# EAGLE design SparkFun_Simblee_Breakout_v11 (EAGLE 7.3.0)
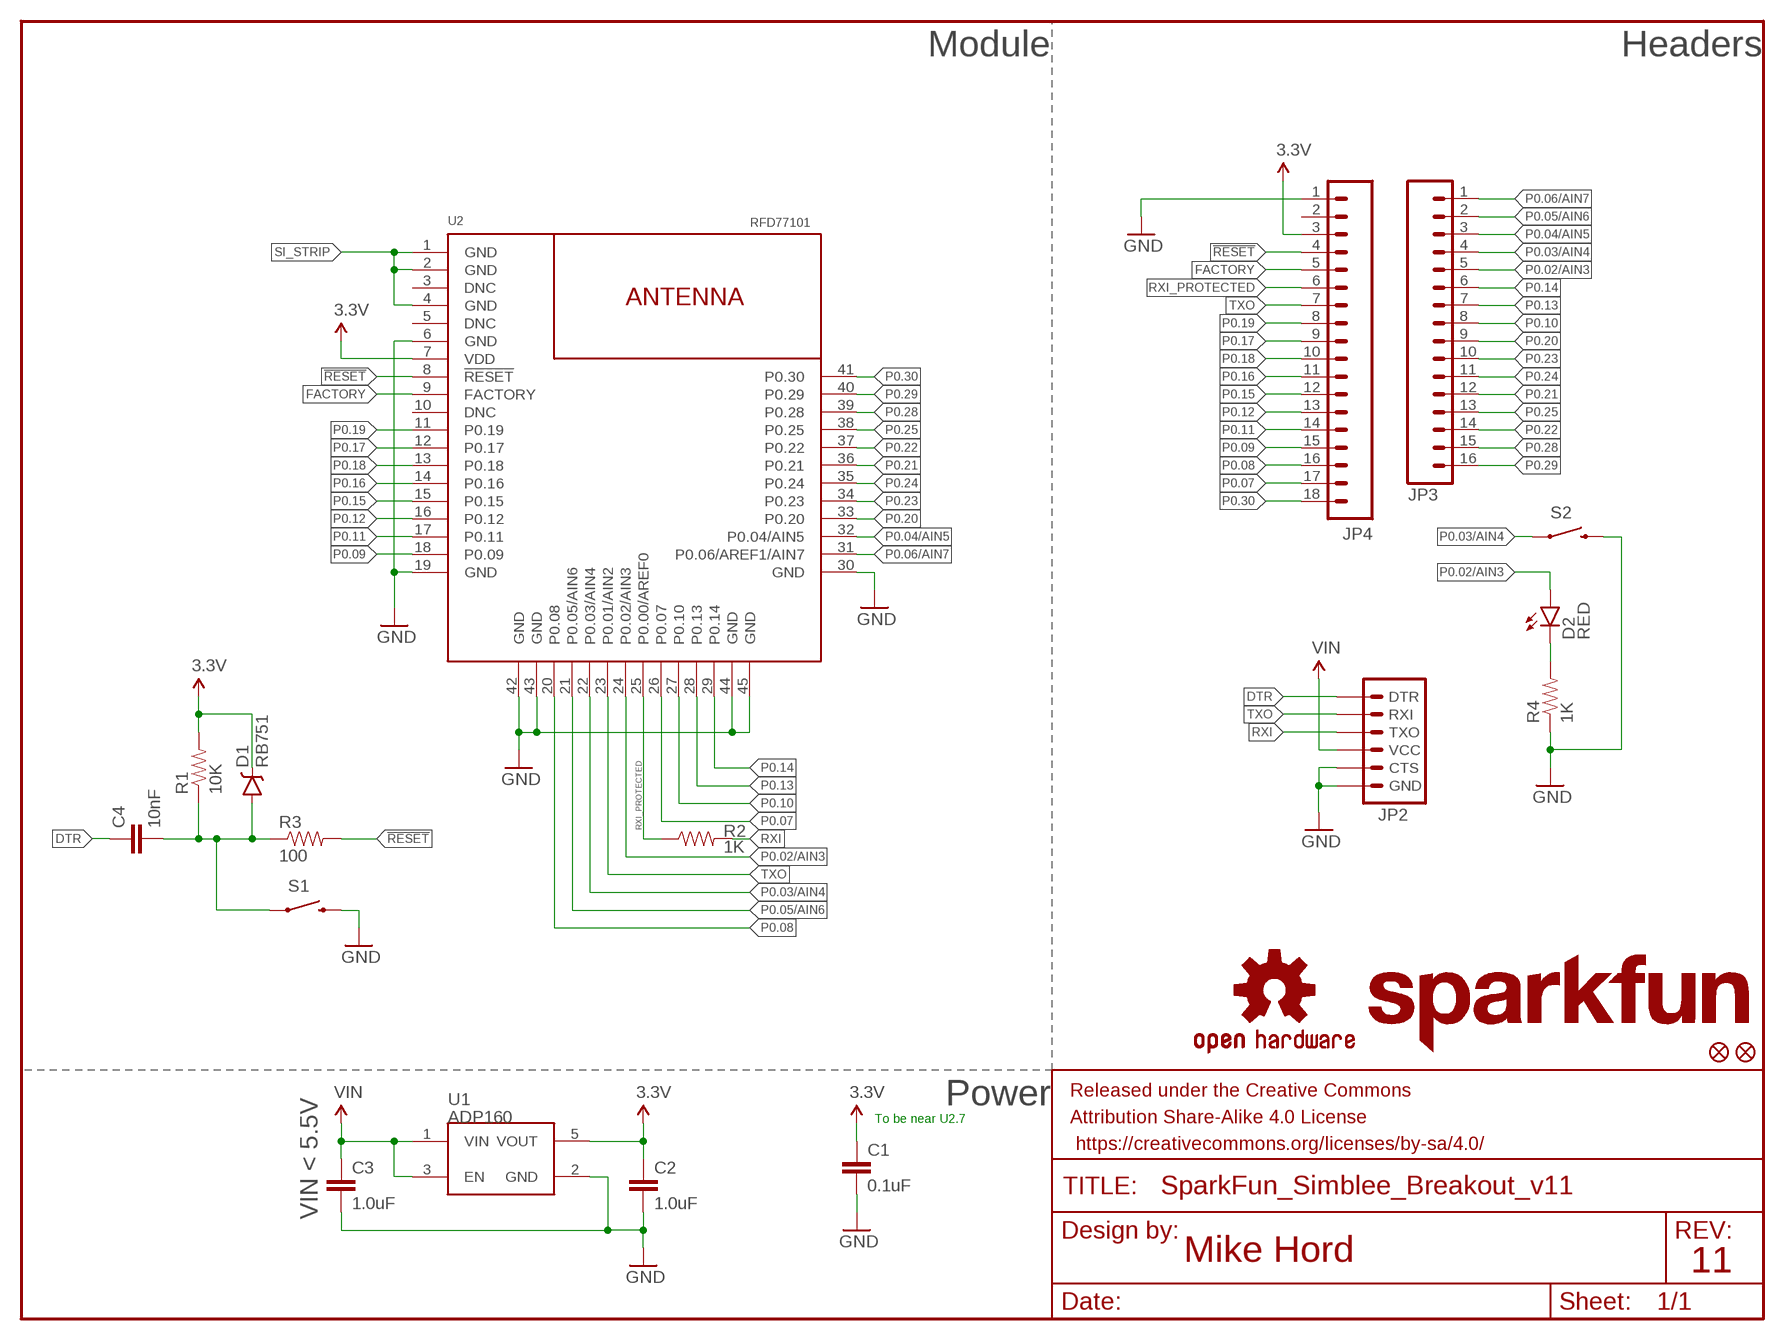
[diagram p0: schematic, sheet 1]

## Parts
C1  0.1uF  0.1UF-25V(+80/-20%)(0603)  [0603-CAP]
C2  1.0uF  1.0UF-16V-10%(0603)  [0603-CAP]
C3  1.0uF  1.0UF-16V-10%(0603)  [0603-CAP]
C4  10nF  10NF/10000PF-50V-10%(0603)  [0603-CAP]
D1  RB751  DIODE-SCHOTTKY-RB751  [SOD-523]
D2  RED  LED-RED0603  [LED-0603]
FID1  FIDUCIALUFIDUCIAL  [MICRO-FIDUCIAL]
FID2  FIDUCIALUFIDUCIAL  [MICRO-FIDUCIAL]
FRAME1  FRAME-LETTER  [CREATIVE_COMMONS]
JP2  ARDUINO_SERIAL_PROGRAMPTH  [1X06]
JP3  M16PTH  [1X16]
JP4  M18_  [1X18]
LOGO1  SFE_LOGO_NAME.1_INCH  [SFE_LOGO_NAME_.1]
LOGO2  OSHW-LOGOS  [OSHW-LOGO-S]
LOGO3  SFE_LOGO_NAME.1_INCH  [SFE_LOGO_NAME_.1]
LOGO4  OSHW-LOGOS  [OSHW-LOGO-S]
R1  10K  10KOHM-1/10W-1%(0603)0603  [0603-RES]
R2  1K  1KOHM-1/10W-1%(0603)  [0603-RES]
R3  100  100OHM-1/10W-1%(0603)  [0603-RES]
R4  1K  1KOHM-1/10W-1%(0603)  [0603-RES]
S1  SWITCH-MOMENTARY-2SMD  [TACTILE-SWITCH-SMD]
S2  SWITCH-MOMENTARY-2SMD  [TACTILE-SWITCH-SMD]
U1  ADP160  [SOT23-5]
U2  RFD77101  [RFD77101]

## Nets
3.3V: C1.1 C2.1 D1.C JP4.3 R1.2 U1.5(VOUT) U2.7(VDD)
!RESET: JP4.4 R3.2 U2.8(!RESET!)
DTR: C4.1 JP2.1(DTR)
FACTORY: JP4.5 U2.9(FACTORY)
GND: C1.2 C2.2 C3.2 JP2.5(CTS) JP2.6(GND) JP4.1 R4.1 S1.3 S2.3 U1.2(GND) U2.6(GND) U2.19(GND) U2.30(GND) U2.42(GND) U2.43(GND) U2.44(GND) U2.45(GND)
N$1: C4.2 D1.A R1.1 R3.1 S1.1
N$2: D2.C R4.2
P0.02/AIN3: D2.A JP3.5 U2.24(P0.02/AIN3)
P0.03/AIN4: JP3.4 S2.1 U2.22(P0.03/AIN4)
P0.04/AIN5: JP3.3 U2.32(P0.04/AIN5)
P0.05/AIN6: JP3.2 U2.21(P0.05/AIN6)
P0.06/AIN7: JP3.1 U2.31(P0.06/AREF1/AIN7)
P0.07: JP4.17 U2.26(P0.07)
P0.08: JP4.16 U2.20(P0.08)
P0.09: JP4.15 U2.18(P0.09)
P0.10: JP3.8 U2.27(P0.10)
P0.11: JP4.14 U2.17(P0.11)
P0.12: JP4.13 U2.16(P0.12)
P0.13: JP3.7 U2.28(P0.13)
P0.14: JP3.6 U2.29(P0.14)
P0.15: JP4.12 U2.15(P0.15)
P0.16: JP4.11 U2.14(P0.16)
P0.17: JP4.9 U2.12(P0.17)
P0.18: JP4.10 U2.13(P0.18)
P0.19: JP4.8 U2.11(P0.19)
P0.20: JP3.9 U2.33(P0.20)
P0.21: JP3.12 U2.36(P0.21)
P0.22: JP3.14 U2.37(P0.22)
P0.23: JP3.10 U2.34(P0.23)
P0.24: JP3.11 U2.35(P0.24)
P0.25: JP3.13 U2.38(P0.25)
P0.28: JP3.15 U2.39(P0.28)
P0.29: JP3.16 U2.40(P0.29)
P0.30: JP4.18 U2.41(P0.30)
RXI: JP2.3(TXO) R2.2
RXI_PROTECTED: JP4.6 R2.1 U2.25(P0.00/AREF0)
SI_STRIP: U2.1(GND) U2.2(GND) U2.4(GND)
TXO: JP2.2(RXI) JP4.7 U2.23(P0.01/AIN2)
VIN: C3.1 JP2.4(VCC) U1.1(VIN) U1.3(EN)
Unconnected: JP4.2 U2.3(DNC) U2.5(DNC) U2.10(DNC)

## Notes on the sheet
- Module | Headers
- Power
- To be near U2.7
- VIN < 5.5V
- Mike Hord
- 11

## Library data of the parts
C1 = SparkFun-Capacitors:0.1UF-25V(+80/-20%)(0603): CAP-00810 Ceramic Standard decoupling cap; PROD_ID: CAP-00810
C2 C3 = SparkFun-Capacitors:1.0UF-16V-10%(0603): CAP-00868; PROD_ID: CAP-00868
C4 = SparkFun-Capacitors:10NF/10000PF-50V-10%(0603): CAP-00867; PROD_ID: CAP-00867
D1 = SparkFun-DiscreteSemi:DIODE-SCHOTTKY: Schottky diodes in SFE's production catalog BAT20J 1A 23V 0.62Vf RB751 120mA 40V 0.37Vf PMEG4005EJ 0.5A 40V 0.42Vf MBRA140 1A 40V 0.5Vf B340A 3A 40V SMA; PROD_ID: DIO-11018
D2 = SparkFun-LED:LED-RED: Assorted Red LEDs LilyPad 1206- DIO-09912 1206- DIO-00809 0603- DIO-00819 "SMART" means more efficient and expensive; PROD_ID: DIO-00819
FID1 FID2 = SparkFun-Aesthetics:FIDUCIAL: Fiducial Alignment Points Various fiducial points for machine vision alignment.
FRAME1 = SparkFun-Aesthetics:FRAME-LETTER: Schematic Frame Standard 8.5x11 US Letter frame
JP2 = SparkFun-Connectors:ARDUINO_SERIAL_PROGRAM: FTDI connector footprints
JP3 = SparkFun-Connectors:M16: 1x16 .1" header
JP4 = SparkFun-Connectors:M18: 1x18 .1" header
LOGO1 LOGO3 = SparkFun-Aesthetics:SFE_LOGO_NAME: SFE Logo, name only This is the SparkFun name logo. The logo on the schematic will always be the same size; the package variant is the height of the flame part of the logo (or the height the flame would be, if it were drawn). Default layer for the logo on the board is tSilk.
LOGO2 LOGO4 = SparkFun-Aesthetics:OSHW-LOGO: Open Source Hardware Logo This logo indicates the piece of hardware it is found on incorporates a OSHW license and/or adheres to the definition of open source hardware found here: http://freedomdefined.org/OSHW
R1 = SparkFun-Resistors:10KOHM-1/10W-1%(0603): RES-00824; PROD_ID: RES-00824
R2 R4 = SparkFun-Resistors:1KOHM-1/10W-1%(0603): RES-07856; PROD_ID: RES-07856
R3 = SparkFun-Resistors:100OHM-1/10W-1%(0603): RES-07863; PROD_ID: RES-07863
S1 S2 = SparkFun-Electromechanical:SWITCH-MOMENTARY-2: Various NO switches- pushbuttons, reed, etc; PROD_ID: SWCH-08247
U1 = SparkFun-PowerIC:ADP160: Nanopower LDO Iq less than 1uA for low Iload; PROD_ID: VREG-11306
U2 = RFDigital:RFD77101: Simblee ™ BLE Module RFD77101 © 2015 RF Digital Corporation www.RFDigital.com www.Simblee.com PATENTS PENDING 04.01.2015; PROD_ID: COMP-13017

## Board
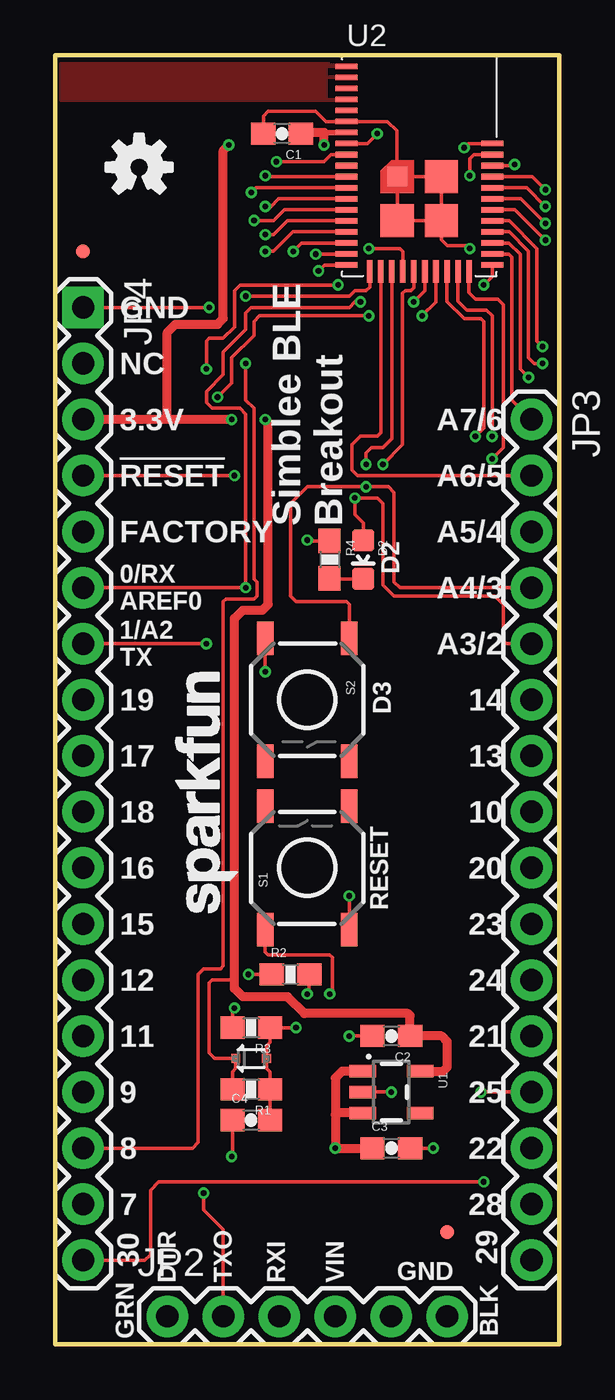
[diagram p1: board, top side]
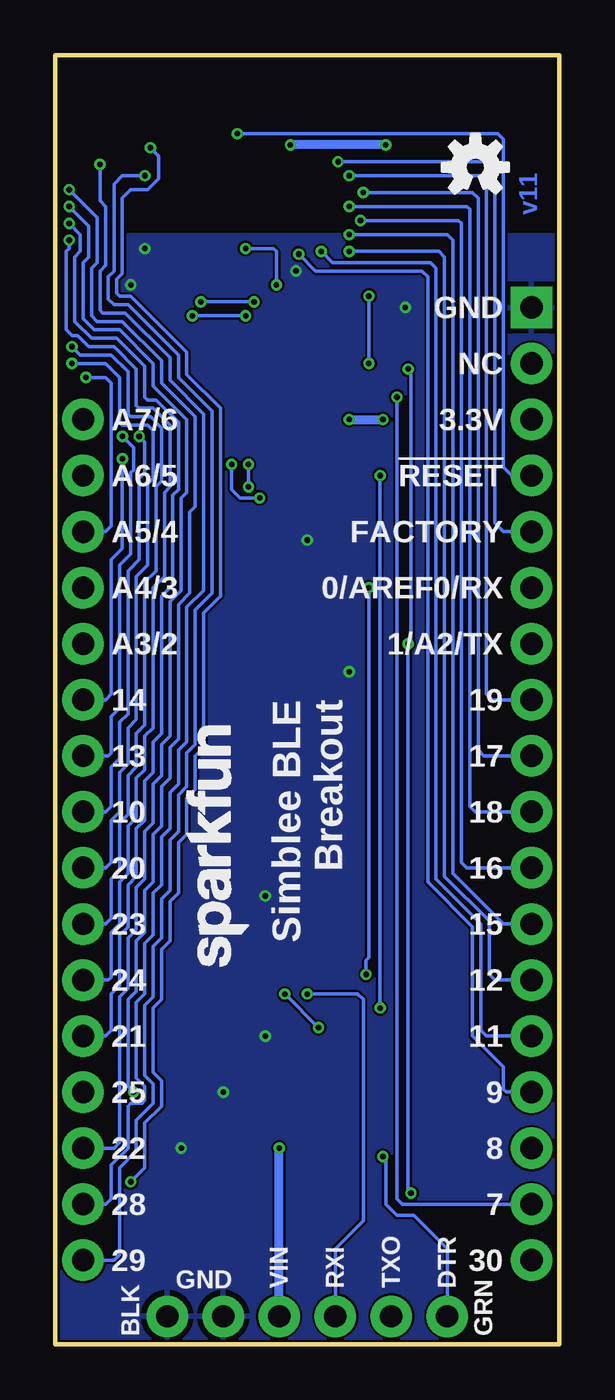
[diagram p2: board, bottom side, seen from below]

Size 22.86 x 58.42 mm. Coordinates in mm from the lower left corner, seen from the top.
Outline: 0,58.42 22.86,58.42 22.86,0 0,0 0,58.42
Copper layers (1*16): Top 0.035mm / dielectric 1.5mm / Bottom 0.035mm
Design rules "SparkFun-2-layer-FAB-LIMIT": minimum track width 4mil, minimum drill 6mil, track to track 4mil, track to pad 4mil, pad to pad 4mil, via to via 4mil, smd to smd 4mil, copper to edge 4mil, drill to drill 4mil, minimum pad ring 5mil, minimum via ring 5mil, stop-mask expansion 4mil, vias tented up to drill 20mil, thermal gap 10mil
tRestrict: area 12.4,56.5 to 12.7,57.3; area 12.4,57.5 to 12.7,57.8

### Footprints (pad centres in the part's own frame; a part is rotated, then mirrored left to right if it is on the bottom)
0603-CAP = smd 1.1 x 1: 1 -0.85,0; 2 0.85,0
SOD-523 = smd 0.4 x 0.4: A -0.7,0; C 0.7,0
LED-0603 = smd 1 x 1: A 0,-0.877; C 0,0.877
MICRO-FIDUCIAL = smd 0.635 x 0.635: 1 0,0
1X06 = drill 1.016 pad 1.88: 1 0,0; 2 2.54,0; 3 5.08,0; 4 7.62,0; 5 10.16,0; 6 12.7,0
1X16 = drill 1.016 pad 1.88: 1 0,0; 2 2.54,0; 3 5.08,0; 4 7.62,0; 5 10.16,0; 6 12.7,0; 7 15.24,0; 8 17.78,0; 9 20.32,0; 10 22.86,0; 11 25.4,0; 12 27.94,0; 13 30.48,0; 14 33.02,0; 15 35.56,0; 16 38.1,0
1X18 = drill 1.016 pad 1.88 square: 1 0,0 | drill 1.016 pad 1.88: 2 2.54,0; 3 5.08,0; 4 7.62,0; 5 10.16,0; 6 12.7,0; 7 15.24,0; 8 17.78,0; 9 20.32,0; 10 22.86,0; 11 25.4,0; 12 27.94,0; 13 30.48,0; 14 33.02,0; 15 35.56,0; 16 38.1,0; 17 40.64,0; 18 43.18,0
0603-RES = smd 1.1 x 1: 1 -0.85,0; 2 0.85,0
TACTILE-SWITCH-SMD = smd 1.524 x 0.762: 1 -2.794,1.905; 2 2.794,1.905; 3 -2.794,-1.905; 4 2.794,-1.905
SOT23-5 = smd 0.55 x 1.2: 1 -0.95,-1.3; 2 0,-1.3; 3 0.95,-1.3; 4 0.95,1.3; 5 -0.95,1.3
RFD77101 = smd 1 x 0.254: 1 0,0; 2 0,-0.5; 3 0,-1; 4 0,-1.5; 5 0,-2; 6 0,-2.5; 7 0,-3; 8 0,-3.5; 9 0,-4; 10 0,-4.5; 11 0,-5; 12 0,-5.5; 13 0,-6; 14 0,-6.5; 15 0,-7; 16 0,-7.5; 17 0,-8; 18 0,-8.5; 19 0,-9; 30 6.61,-9; 31 6.61,-8.5; 32 6.61,-8; 33 6.61,-7.5; 34 6.61,-7; 35 6.61,-6.5; 36 6.61,-6; 37 6.61,-5.5; 38 6.61,-5; 39 6.61,-4.5; 40 6.61,-4; 41 6.61,-3.5 | smd 0.254 x 1: 20 1.055,-9.29; 21 1.555,-9.29; 22 2.055,-9.29; 23 2.555,-9.29; 24 3.055,-9.29; 25 3.555,-9.29; 26 4.055,-9.29; 27 4.555,-9.29; 28 5.055,-9.29; 29 5.555,-9.29 | smd 0.9 x 0.9: 42 2.3,-4.99 | smd 1.5 x 1.5: 43 2.3,-6.99; 44 4.3,-6.99; 45 4.3,-4.99

### Placement (x,y rotation side)
C1  10.29,54.86 180 top
C2  15.24,13.97 180 top
C3  15.24,8.89 0 top
C4  8.89,10.16 0 top
D1  8.89,12.95 180 top
D2  13.97,35.56 180 top
FID1  17.78,5.08 0 top
FID2  1.27,49.53 0 top
FRAME1  0,-20.32 0 top  (outside the outline)
JP2  5.08,1.27 0 top
JP3  21.59,41.91 270 top
JP4  1.27,46.99 270 top
LOGO1  8.76,19.05 90 top
LOGO2  3.81,53.34 0 top
LOGO3  13.59,16.64 90 bottom
LOGO4  3.81,53.34 0 bottom
R1  8.89,11.56 180 top
R2  10.67,16.76 0 top
R3  8.89,14.35 180 top
R4  12.45,35.56 270 top
S1  11.43,21.59 90 top
S2  11.43,29.21 270 top
U1  15.24,11.43 270 top
U2  13.21,57.91 0 top

### Tracks (layer width: path | path; a pad name or v marks a point on that pad's centre or on a via)
3.3V  (via drill 0.25)
  Top 0.152: R1.2 8.04,12.36 8.19,12.51 D1.C 7.24,12.95 6.99,13.21 6.99,16.38 7.11,16.51 8.13,16.51 | 11.19,54.91 C1.1
  Top 0.254: U2.7 12.19,54.91
  Top 0.406: U1.5 17.59,12.38 17.78,12.57 17.78,13.72 17.53,13.97 C2.1 16.09,14.9 16,14.99 11.3,14.99 10.54,15.75 8.51,15.75 8.13,16.13 8.13,16.51 8.13,32.89 8.51,33.27 9.4,33.27 9.65,33.53 9.65,41.78 v9.53,41.91 | v8,41.91 5.08,41.91 | 5.08,41.91 JP4.3 | 11.19,54.91 12.19,54.91 v12.19,54.36 | 5.08,41.91 5.08,45.85 5.46,46.23 7.37,46.23 7.62,46.48 7.62,54.1 v7.87,54.36
  Bottom 0.406: v9.53,41.91 v8,41.91 | v7.87,54.36 v12.19,54.36
!RESET  (via drill 0.25)
  Top 0.152: U2.8 14.15,54.41 v14.61,54.86 | v8.13,39.37 JP4.4 | R3.2 8.04,15.15 v8.13,15.24
  Bottom 0.152: v14.61,54.86 2.79,54.86 2.54,54.61 2.54,39.75 2.16,39.37 JP4.4 | v8.13,15.24 v8.13,39.37
DTR  (via drill 0.25)
  Top 0.152: C4.1 8.04,8.55 v8,8.51
  Bottom 0.152: v8,8.51 7.87,8.38 7.87,6.35 7.37,5.84 6.6,5.84 5.08,4.32 JP2.1
FACTORY  (via drill 0.25)
  Top 0.152: U2.9 12.51,53.91 12.19,53.59 v10.03,53.59
  Bottom 0.152: v10.03,53.59 3.05,53.59 2.92,53.47 2.92,37.21 2.54,36.83 JP4.5
GND  (via drill 0.25)
  Top 0.152: U1.2 v15.24,11.43 | C3.2 v17.14,8.89 | C2.2 v13.34,13.97 | JP4.1 v6.99,46.99 | U2.19 12.21,48.91 v11.94,48.64 | U2.42 U2.43 U2.44 | U2.42 15.49,52.94 15.49,54.99 15.07,55.41 U2.6 12.28,55.41 11.81,55.88 9.65,55.88 9.44,55.66 C1.2 | U2.44 17.51,50.06 17.78,49.78 18.67,49.78 v18.8,49.66 | U2.30 19.82,48.39 v19.43,48.01 | U2.45 U2.44 | U2.42 17.36,52.92 17.78,53.34 | S2.3 v9.53,30.48 | S1.3 v13.34,20.32 | R4.1 11.47,36.41 v11.43,36.45
  pour Bottom: 0,50.29 22.86,50.29 22.86,0 0,0
N$1  (via drill 0.25)
  Top 0.152: C4.2 R1.1 9.74,12.36 9.59,12.51 D1.A 9.59,13.53 9.74,13.68 R3.1 v10.92,14.35 | S1.1 9.53,17.78 9.65,17.65 12.45,17.65 12.57,17.53 12.57,16 v12.45,15.88
  Bottom 0.152: v12.45,15.88 v10.92,14.35
N$2
  Top 0.152: D2.C 12.47,34.68 R4.2
P0.02/AIN3  (via drill 0.25)
  Top 0.152: U2.24 16.26,47.89 16.13,47.75 15.88,47.75 15.75,47.62 15.75,40.77 v14.86,39.88 | JP3.5 20.45,31.75 20.32,31.88 20.32,33.53 19.94,33.91 15.37,33.91 14.86,34.42 14.86,38.1 14.61,38.35 v13.59,38.35 13.59,37.59 13.97,37.21 D2.A
  Bottom 0.152: v14.86,39.88 14.86,38.73 14.48,38.35 v13.59,38.35
P0.03/AIN4  (via drill 0.25)
  Top 0.152: 13.99,39.98 v14.1,39.88 14.1,40.39 14.35,40.64 14.86,40.64 15.26,41.04 U2.22 | JP3.4 15.62,34.29 15.37,34.54 15.37,38.61 15.11,38.86 v14.1,38.86 11.43,38.86 10.67,38.1 10.67,33.91 10.92,33.66 13.21,33.66 13.34,33.53 S2.1
  Bottom 0.152: v14.1,39.88 v14.1,38.86
P0.04/AIN5  (via drill 0.25)
  Top 0.152: U2.32 20.57,49.91 21.08,49.4 21.08,44.2 v21.46,43.81
  Bottom 0.152: v21.46,43.81 20.57,43.81 20.32,43.56 20.32,37.08 20.57,36.83 JP3.3
P0.05/AIN6
  Top 0.152: JP3.2 13.72,39.37 13.46,39.62 13.46,40.77 13.84,41.15 14.61,41.15 14.76,41.31 U2.21
P0.06/AIN7
  Top 0.152: U2.31 20.57,49.41 20.7,49.28 20.7,42.8 JP3.1
P0.07  (via drill 0.25)
  Top 0.152: U2.26 17.26,47.23 v16.64,46.61 | v14.22,46.61 9.27,46.61 9.02,46.35 9.02,45.72 8,44.7 8,43.56 v7.37,42.93
  Bottom 0.152: v7.37,42.93 7.37,6.6 7.11,6.35 JP4.17 | v16.64,46.61 v14.22,46.61
P0.08  (via drill 0.25)
  Top 0.152: U2.20 14.26,47.92 14.1,47.75 13.59,47.75 13.34,47.5 v8.64,47.5 | v8.64,44.45 8.64,42.8 9.02,42.42 9.02,34.67 9.14,34.54 9.14,33.91 9.02,33.78 7.75,33.78 7.62,33.66 7.62,17.14 7.49,17.02 6.73,17.02 6.48,16.76 6.48,9.14 6.22,8.89 JP4.16
  Bottom 0.152: v8.64,47.5 v8.64,44.45
P0.09  (via drill 0.25)
  Top 0.152: U2.18 11.82,49.41 v11.81,49.4
  Bottom 0.152: v11.81,49.4 11.05,48.64 6.22,48.64 5.97,48.39 5.97,20.95 3.94,18.92 3.94,13.97 2.54,12.57 2.54,11.56 2.41,11.43 JP4.15
P0.10  (via drill 0.25)
  Top 0.152: U2.27 17.76,47.26 18.54,46.48 19.3,46.48 19.43,46.35 19.43,41.53 v19.05,41.15
  Bottom 0.152: v19.05,41.15 18.8,40.89 18.8,39.5 19.05,39.24 19.05,35.56 19.56,35.05 19.56,28.57 19.94,28.19 19.94,26.54 20.32,26.16 20.32,24.38 20.57,24.13 JP3.8
P0.11  (via drill 0.25)
  Top 0.152: U2.17 11.18,49.91 v10.79,49.53
  Bottom 0.152: v10.79,49.53 10.29,49.02 5.84,49.02 5.59,48.77 5.59,21.08 3.56,19.05 3.56,14.22 3.3,13.97 JP4.14
P0.12  (via drill 0.25)
  Top 0.152: U2.16 10.79,50.41 9.91,49.53 v9.53,49.53
  Bottom 0.152: v9.53,49.53 5.46,49.53 5.21,49.28 5.21,21.21 3.17,19.18 3.17,16.76 2.92,16.51 JP4.13
P0.13  (via drill 0.25)
  Top 0.152: U2.28 18.26,47.27 18.67,46.86 19.56,46.86 19.81,46.61 v19.81,41.15
  Bottom 0.152: v19.81,41.15 19.3,40.64 19.3,39.62 19.43,39.5 19.43,35.81 19.94,35.31 19.94,28.83 20.32,28.45 20.32,26.8 20.45,26.67 JP3.7
P0.14  (via drill 0.25)
  Top 0.152: U2.29 18.76,47.66 19.05,47.37 20.07,47.37 20.32,47.12 20.32,40.64 v19.81,40.13
  Bottom 0.152: v19.81,40.13 19.81,36.07 20.32,35.56 20.32,29.46 20.57,29.21 JP3.6
P0.15  (via drill 0.25)
  Top 0.152: U2.15 10.53,50.91 9.91,50.29 v9.53,50.29
  Bottom 0.152: v9.53,50.29 5.08,50.29 4.83,50.04 4.83,21.34 2.54,19.05 JP4.12
P0.16  (via drill 0.25)
  Top 0.152: U2.14 10.39,51.41 9.91,50.93 v9.02,50.93
  Bottom 0.152: v9.02,50.93 4.57,50.93 4.45,50.8 4.45,21.84 4.19,21.59 JP4.11
P0.17  (via drill 0.25)
  Top 0.152: U2.12 9.11,52.41 v8.89,52.2
  Bottom 0.152: v8.89,52.2 3.94,52.2 3.68,51.94 3.68,26.92 3.43,26.67 JP4.9
P0.18  (via drill 0.25)
  Top 0.152: U2.13 10.13,51.91 9.78,51.56 v9.53,51.56
  Bottom 0.152: v9.53,51.56 4.19,51.56 4.06,51.44 4.06,24.38 3.81,24.13 JP4.10
P0.19  (via drill 0.25)
  Top 0.152: U2.11 9.57,52.91 v9.53,52.96
  Bottom 0.152: v9.53,52.96 3.56,52.96 3.3,52.7 3.3,29.46 3.05,29.21 JP4.8
P0.20  (via drill 0.25)
  Top 0.152: U2.33 20.58,50.41 21.46,49.53 21.46,44.7 21.72,44.45 v22.1,44.45
  Bottom 0.152: v22.1,44.45 20.57,44.45 19.94,43.81 19.94,41.78 19.81,41.66 18.67,41.66 18.41,41.4 18.41,39.24 18.67,38.99 18.67,35.31 19.18,34.8 19.18,28.32 19.56,27.94 19.56,26.29 19.94,25.91 19.94,24.13 20.32,23.75 20.32,21.84 20.57,21.59 JP3.9
P0.21  (via drill 0.25)
  Top 0.152: U2.36 21.11,51.91 v22.23,50.8
  Bottom 0.152: v22.23,50.8 21.72,50.29 21.72,49.53 21.97,49.28 21.97,46.35 21.21,45.59 20.07,45.59 18.8,44.32 18.8,42.93 18.67,42.8 18.29,42.8 17.27,41.78 17.27,38.73 17.53,38.48 17.53,34.42 18.03,33.91 18.03,27.69 18.41,27.3 18.41,25.91 18.8,25.53 18.8,23.75 19.18,23.37 19.18,21.21 19.56,20.83 19.56,18.92 19.94,18.54 19.94,16.26 20.32,15.88 20.32,14.22 20.57,13.97 JP3.12
P0.22  (via drill 0.25)
  Top 0.152: U2.37 21.38,52.41 v22.23,51.56
  Bottom 0.152: v22.23,51.56 21.34,50.67 21.34,49.28 21.59,49.02 21.59,46.48 21.08,45.97 19.94,45.97 18.41,44.45 18.41,43.43 16.89,41.91 16.89,38.61 17.14,38.35 17.14,34.16 17.65,33.66 17.65,27.56 18.03,27.18 18.03,25.78 18.41,25.4 18.41,23.62 18.8,23.24 18.8,21.08 19.18,20.7 19.18,18.8 19.56,18.41 19.56,16.13 19.94,15.75 19.94,9.14 20.19,8.89 JP3.14
P0.23  (via drill 0.25)
  Top 0.152: U2.34 20.59,50.91 21.84,49.66 21.84,45.47 v22.1,45.21
  Bottom 0.152: v22.1,45.21 21.72,44.83 20.32,44.83 19.56,44.07 19.56,42.16 19.43,42.04 18.54,42.04 18.03,41.53 18.03,39.12 18.29,38.86 18.29,35.05 18.8,34.54 18.8,28.07 19.18,27.69 19.18,26.16 19.56,25.78 19.56,24 19.94,23.62 19.94,21.46 20.32,21.08 20.32,19.3 20.57,19.05 JP3.10
P0.24  (via drill 0.25)
  Top 0.152: U2.35 20.85,51.41 v22.23,50.04
  Bottom 0.152: v22.23,50.04 22.23,49.66 22.35,49.53 22.35,45.97 22.1,45.72 21.84,45.72 21.34,45.21 20.19,45.21 19.18,44.2 19.18,42.55 19.05,42.42 18.41,42.42 17.65,41.66 17.65,38.86 17.91,38.61 17.91,34.8 18.41,34.29 18.41,27.94 18.8,27.56 18.8,26.04 19.18,25.65 19.18,23.88 19.56,23.5 19.56,21.34 19.94,20.95 19.94,19.05 20.32,18.67 20.32,16.64 20.45,16.51 JP3.11
P0.25  (via drill 0.25)
  Top 0.152: U2.38 21.64,52.91 v22.23,52.32 | v19.3,11.43 JP3.13
  Bottom 0.152: v22.23,52.32 20.95,51.05 20.95,49.02 21.21,48.77 21.21,46.61 20.95,46.35 19.81,46.35 18.03,44.58 18.03,43.56 16.51,42.04 16.51,37.97 16.76,37.72 16.76,34.04 17.27,33.53 17.27,27.43 17.65,27.05 17.65,25.65 18.03,25.27 18.03,23.5 18.41,23.11 18.41,20.95 18.8,20.57 18.8,18.67 19.18,18.29 19.18,16 19.56,15.62 19.56,11.68 v19.3,11.43
P0.28  (via drill 0.25)
  Top 0.152: U2.39 20.77,53.41 v20.83,53.47
  Bottom 0.152: JP3.15 20.57,6.35 20.32,6.6 20.32,8.13 19.56,8.89 19.56,10.79 19.43,10.92 18.92,10.92 18.8,11.05 18.8,11.68 19.18,12.06 19.18,15.49 18.8,15.88 18.8,18.16 18.41,18.54 18.41,20.45 18.03,20.83 18.03,22.99 17.65,23.37 17.65,25.02 17.27,25.4 17.27,26.92 16.89,27.3 16.89,33.4 16.13,34.16 16.13,42.16 17.65,43.69 17.65,44.7 19.68,46.74 20.7,46.74 20.83,46.86 20.83,48.64 20.57,48.9 20.57,51.56 20.83,51.82 v20.83,53.47
P0.29  (via drill 0.25)
  Top 0.152: U2.40 18.99,53.91 18.8,53.72 v18.8,52.96
  Bottom 0.152: v18.8,52.96 19.81,52.96 20.19,52.58 20.19,48.64 20.45,48.39 20.45,47.37 20.19,47.12 19.56,47.12 17.27,44.83 17.27,43.81 15.75,42.29 15.75,34.04 16.51,33.27 16.51,27.18 16.89,26.8 16.89,25.27 17.27,24.89 17.27,23.24 17.65,22.86 17.65,20.57 18.03,20.19 18.03,18.41 18.41,18.03 18.41,15.75 18.8,15.37 18.8,12.19 18.41,11.81 18.41,10.92 19.18,10.16 19.18,8.76 19.94,8 19.94,4.06 20.19,3.81 JP3.16
P0.30  (via drill 0.25)
  Top 0.152: v19.43,7.37 4.7,7.37 4.32,6.99 4.32,4.06 4.06,3.81 JP4.18 | U2.41 18.73,54.41 v18.54,54.23
  Bottom 0.152: v18.54,54.23 18.16,53.85 18.16,52.83 18.67,52.32 19.43,52.32 19.81,51.94 19.81,48.51 20.07,48.26 20.07,47.62 19.94,47.5 19.43,47.5 16.89,44.96 16.89,43.94 15.37,42.42 15.37,33.91 16.13,33.15 16.13,27.05 16.51,26.67 16.51,25.15 16.89,24.77 16.89,23.11 17.27,22.73 17.27,20.45 17.65,20.07 17.65,18.29 18.03,17.91 18.03,15.62 18.41,15.24 18.41,12.32 18.03,11.94 18.03,10.79 18.8,10.03 18.8,8 v19.43,7.37
RXI  (via drill 0.25)
  Top 0.152: R2.2 11.52,15.96 v11.43,15.88
  Bottom 0.152: v11.43,15.88 9.14,15.88 8.89,15.62 8.89,5.59 10.16,4.32 JP2.3
RXI_PROTECTED  (via drill 0.25)
  Top 0.152: 2.29,34.29 JP4.6 v8.64,34.29 8.64,42.16 8.38,42.42 7.11,42.42 6.86,42.67 6.86,43.18 7.62,43.94 7.62,44.96 8.64,45.97 8.64,46.74 8.89,46.99 13.34,46.99 13.59,47.24 v13.84,47.24 | R2.1 v8.76,16.76 | U2.25 16.76,47.75 v16.26,47.24
  Bottom 0.152: v8.76,16.76 8.76,17.4 8.64,17.53 v8.64,34.29 | v16.26,47.24 v13.84,47.24
SI_STRIP
  pour Top: 12.95,58.04 0.25,58.04 0.25,56.39 12.95,56.39
TXO  (via drill 0.25)
  Top 0.152: v6.86,31.75 JP4.7 | U2.23 15.76,49.52 15.62,49.66 v14.22,49.66 | v12.83,48.01 8.38,48.01 8.13,47.75 8.13,46.1 7.62,45.59 6.99,45.59 6.86,45.47 v6.86,44.2 | v6.73,6.86 6.73,6.1 7.62,5.21 JP2.2
  Bottom 0.152: v6.86,44.2 6.86,44.07 6.73,43.94 6.73,31.88 v6.86,31.75 6.86,6.99 v6.73,6.86 | v14.22,49.66 12.95,49.66 12.83,49.53 v12.83,48.01
VIN  (via drill 0.25)
  Top 0.152: 12.77,10.48 12.7,10.41
  Top 0.406: C3.1 v12.7,8.89 12.7,10.41 12.7,12.06 13.02,12.38 U1.1 | U1.3 12.77,10.48
  Bottom 0.406: JP2.4 v12.7,8.89

### Text on the board
Bottom: v11
tPlace: GND | NC | 3.3V | A7/6 | !RESET | A6/5 | FACTORY | Simblee BLE / Breakout | A5/4 | D2 | 0/RX / AREF0 | A4/3 | 1/A2 / TX | A3/2 | 19 | D3 | 14 | 17 | 13 | 18 | 10 | 16 | 20 | RESET | 15 | 23 | 12 | 24 | 11 | 21 | 9 | 25 | 8 | 22 | 7 | 28 | 30 | 29 | DTR | TXO | RXI | VIN | GND | GRN | BLK
bPlace: GND | NC | 3.3V | A7/6 | !RESET | A6/5 | FACTORY | A5/4 | 0/AREF0/RX | A4/3 | 1/A2/TX | A3/2 | 19 | Simblee BLE / Breakout | 14 | 17 | 13 | 18 | 10 | 16 | 20 | 15 | 23 | 12 | 24 | 11 | 21 | 9 | 25 | 8 | 22 | 7 | 28 | 30 | 29 | DTR | TXO | RXI | VIN | GND | GRN | BLK
Measures: Dimensions in inches
tDocu: Mike Hord